# EasyEDA schematic SCH_HUD Speedo_EasyEDA.json
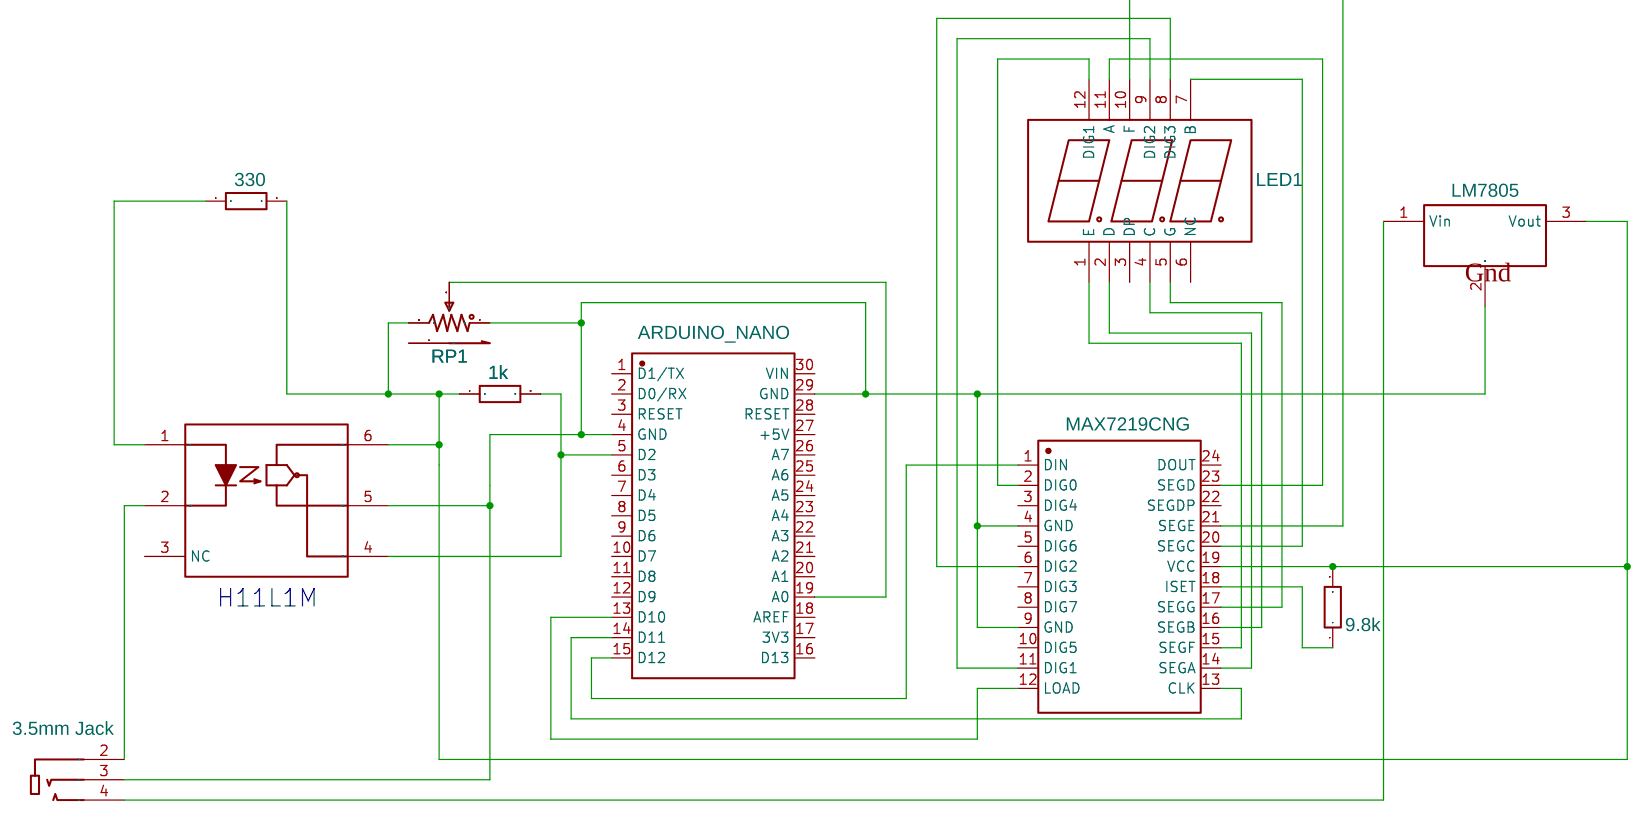
[diagram p0: schematic sheet]

## Parts
ARDUINO_NANO  ARDUINO_NANO  [COMM-TH_ARDUINO_NANO]
CN1  3.5mm Jack  [AUDIO-TH_PJ-3136-B]
DA1  LM7805  [LM7805]
LED1  SLR0523DWC1BD  [LED-SEG-TH_SLR0523DWC1BD]
R1  9.8k  [RES-TH_BD2.5-L6.5-P10.50-D0.6]
R2  330  [RES-TH_BD2.5-L6.5-P10.50-D0.6]
R3  1k  [RES-TH_BD2.5-L6.5-P10.50-D0.6]
RP1  RK09K1130ACM  [RK09K113]
U1  MAX7219CNG  [DIP-24_L31.7-W6.6-P2.54-LS7.6-BL-2]
U5  H11L1M  [DIP-6_L8.8-W6.4-P2.54-LS7.6-BL]

## Library data of the parts
ARDUINO_NANO = ARDUINO_NANO: Supplier: LCSC; Supplier Part: C9900017879; Manufacturer: null; JLCPCB Part Class: Extended Part; Contributor: lcsc
CN1 = PJ-3136-B: Supplier: LCSC; Supplier Part: C381131; Manufacturer: XKB Enterprise; Contributor: photobogun; JLCPCB Part Class: Extended Part
DA1 = LM7805: Contributor: เด็กช่างบ้านๆ
LED1 = SLR0523DWC1BD: Supplier: LCSC; Supplier Part: C225931; Manufacturer: SUNLIGHT; Contributor: LCSC; JLCPCB Part Class: Extended Part
R1-R3 = MFR0W4F1503A50: Supplier: LCSC; Manufacturer: UniOhm; Supplier Part: C58618; JLCPCB Part Class: Extended Part; Resistance: 150kΩ
RP1 = RK09K1130ACM: Manufacturer: ALPSALPINE; Supplier: LCSC; Supplier Part: C470290; link: https://www.lcsc.com/product-detail/Variable-Resistors-Potentiometers_ALPSALPINE-RK09K1130ACM_C470290.html; Contributor: 40thougths
U1 = max7219cng: Supplier: LCSC; Manufacturer: MAXIM; Supplier Part: C29160; JLCPCB Part Class: Extended Part
U5 = H11L1M: Supplier: LCSC; Manufacturer: onsemi(安森美); Supplier Part: C16587; JLCPCB Part Class: Extended Part

## Nets
Net-(ARDUINO_NANO-4): ARDUINO_NANO.4(GND) ARDUINO_NANO.29(GND) CN1.3 DA1.2(GND) RP1.1 U1.4(GND) U1.9(GND) U5.5(GND)
Net-(ARDUINO_NANO-5): ARDUINO_NANO.5(D2) R3.2 U5.4(VO)
Net-(ARDUINO_NANO-13): ARDUINO_NANO.13(D10) U1.12(LOAD)
Net-(ARDUINO_NANO-14): ARDUINO_NANO.14(D11) U1.13(CLK)
Net-(ARDUINO_NANO-15): ARDUINO_NANO.15(D12) U1.1(DIN)
Net-(ARDUINO_NANO-19): ARDUINO_NANO.19(A0) RP1.2
Net-(CN1-2): CN1.2 U5.2(CAT)
Net-(CN1-4): CN1.4 DA1.1(Vin)
Net-(DA1-3): DA1.3(Vout) R1.2 R2.2 R3.1 RP1.3 U1.19(VCC) U5.6(VCC)
Net-(LED1-1): LED1.1(E) U1.15(SEGF)
Net-(LED1-2): LED1.2(D) U1.14(SEGA)
Net-(LED1-4): LED1.4(C) U1.16(SEGB)
Net-(LED1-5): LED1.5(G) U1.17(SEGG)
Net-(LED1-7): LED1.7(B) U1.20(SEGC)
Net-(LED1-8): LED1.8(DIG3) U1.6(DIG2)
Net-(LED1-9): LED1.9(DIG2) U1.11(DIG1)
Net-(LED1-10): LED1.10(F) U1.21(SEGE)
Net-(LED1-11): LED1.11(A) U1.23(SEGD)
Net-(LED1-12): LED1.12(DIG1) U1.2(DIG0)
Net-(R1-1): R1.1 U1.18(ISET)
Net-(R2-1): R2.1 U5.1(AN)

Not connected (* = marked no-connect by the designer): ARDUINO_NANO 1(D1/TX) 2(D0/RX) 3(RESET) 6(D3) 7(D4) 8(D5) 9(D6) 10(D7) 11(D8) 12(D9) 16(D13) 17(3V3) 18(AREF) 20(A1) 21(A2) 22(A3) 23(A4) 24(A5) 25(A6) 26(A7) 27(+5V) 28(RESET) 30(VIN); LED1 3(DP) 6(NC); RP1 4; U1 3(DIG4) 5(DIG6) 7(DIG3) 8(DIG7) 10(DIG5) 22(SEGDP) 24(DOUT); U5 3(NC)

## Notes on the sheet
- H11L1M
